# EAGLE design TrinketBlinkM0B (EAGLE 8.4.2)
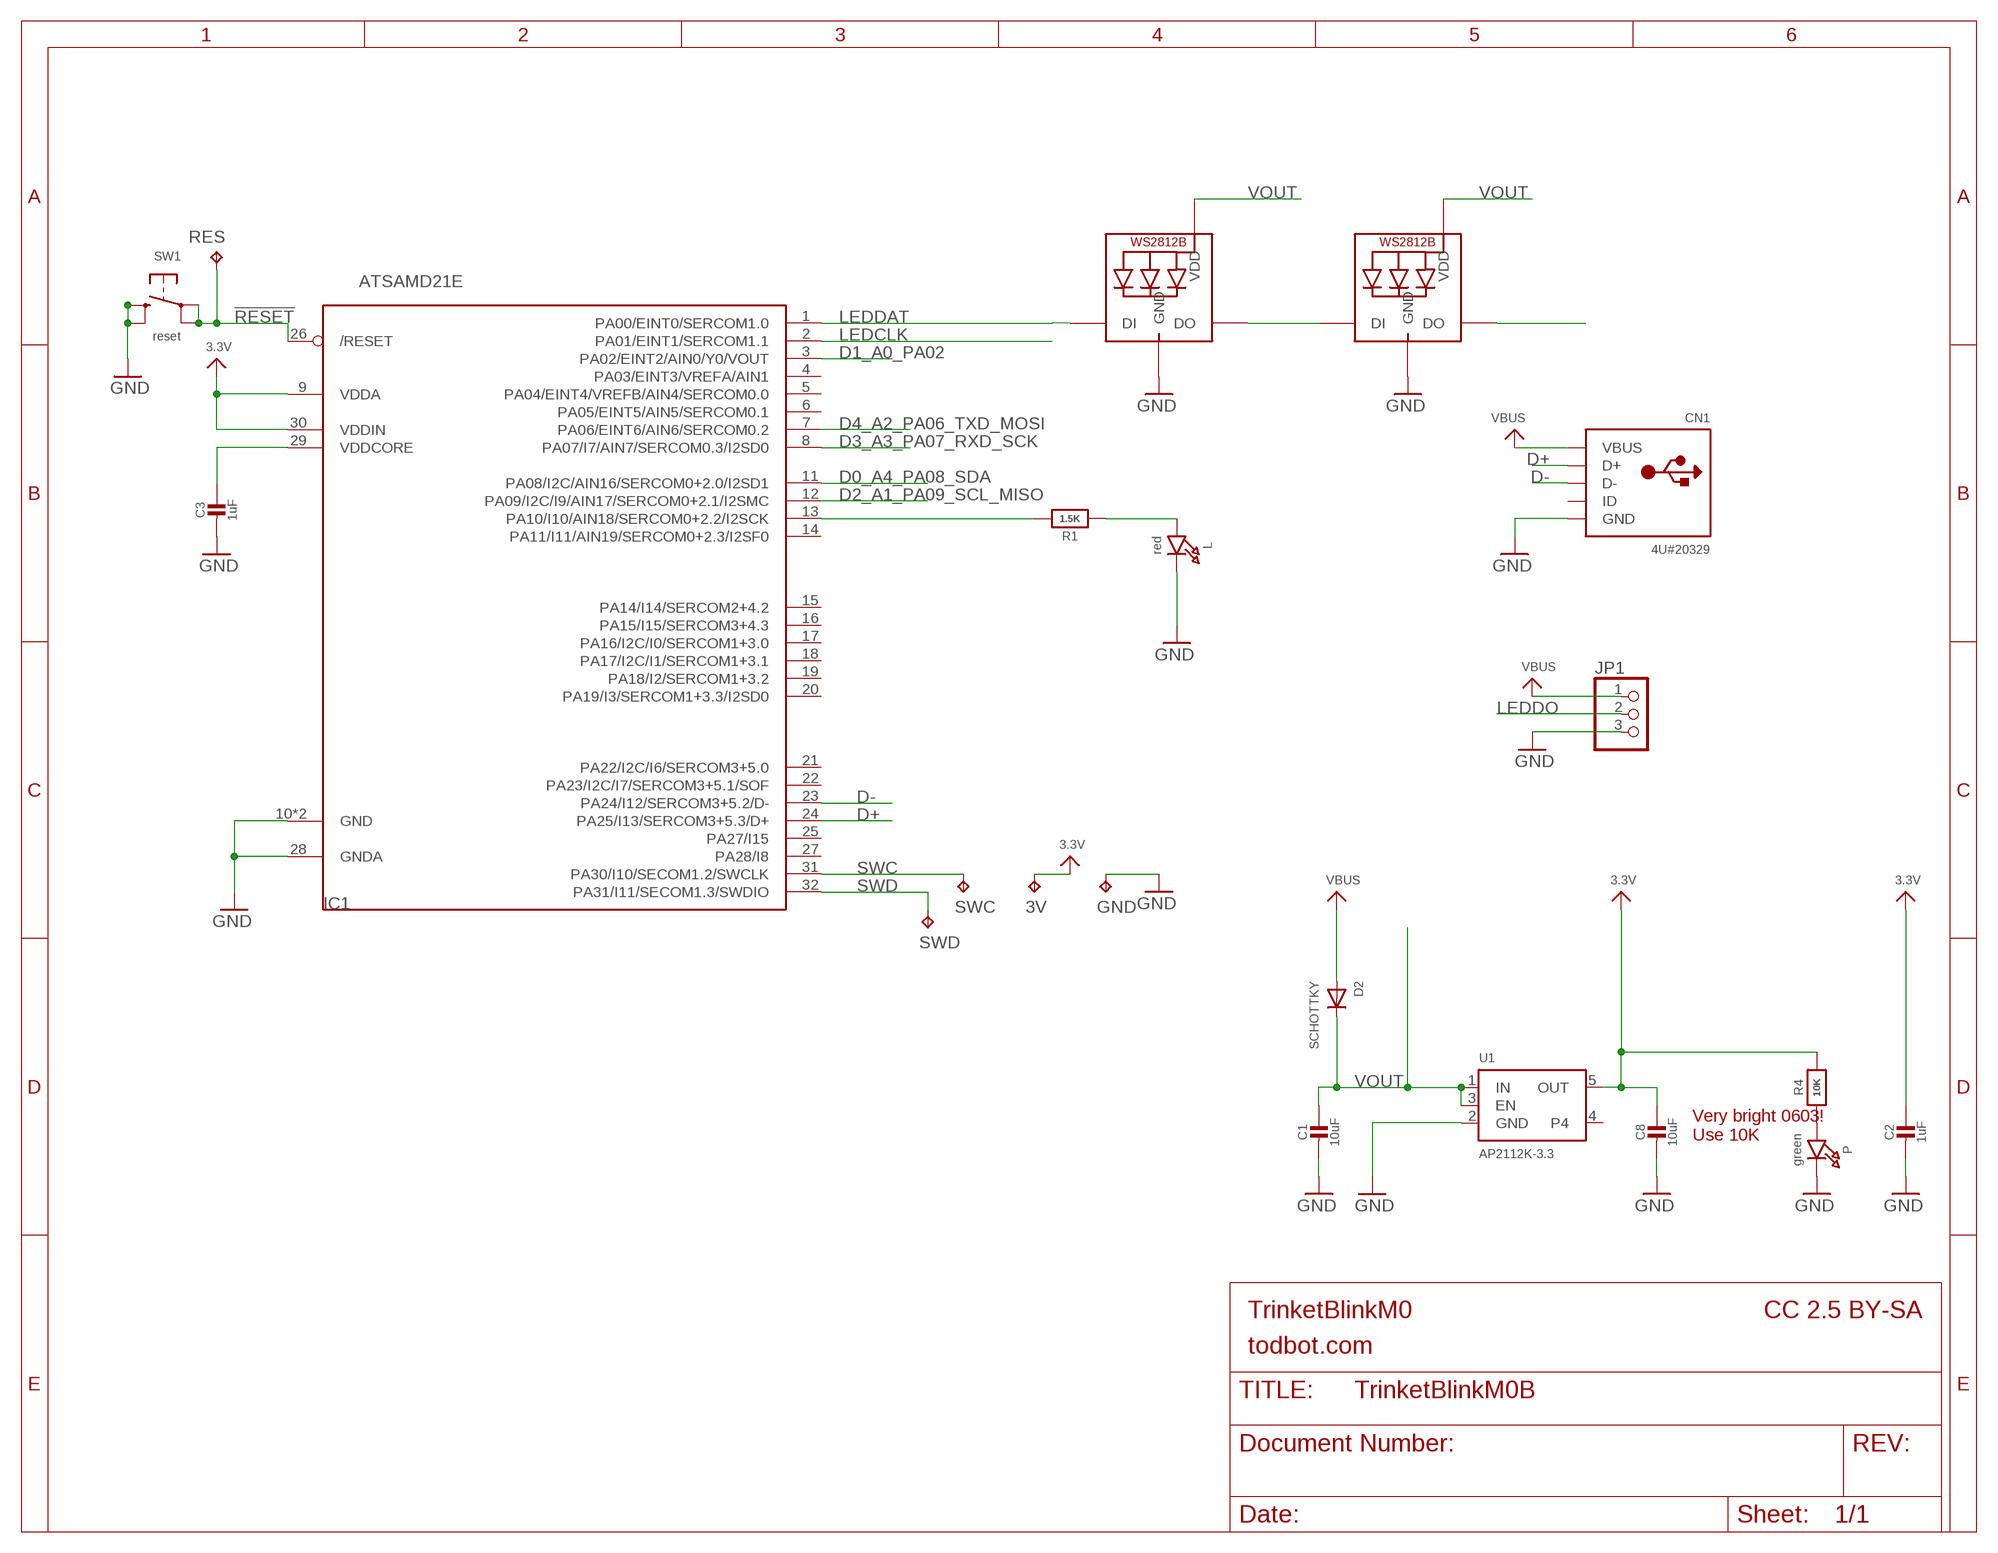
[diagram p0: schematic, sheet 1]

## Parts
3V  TPB1,27  [B1,27]
C1  10uF  CAP_CERAMIC0805-NOOUTLINE  [0805-NO]
C2  1uF  CAP_CERAMIC0603_NO  [0603-NO]
C3  1uF  CAP_CERAMIC0603_NO  [0603-NO]
C8  10uF  CAP_CERAMIC0805-NOOUTLINE  [0805-NO]
CN1  4U#20329  USB_MICRO_20329_V2  [4UCONN_20329_V2]
D2  SCHOTTKY  DIODE_SOD-123FL  [SOD-123FL]
GND  TPB1,27  [B1,27]
IC1  ATSAMD21E  [QFN32_5MM]
JP1  PINHD-1X3CB  [1X03-CLEANBIG]
L  red  LED0603_NOOUTLINE  [CHIPLED_0603_NOOUTLINE]
LED1  WS2812B_5050N  [WS2812B-NARROW]
LED2  WS2812B_5050N  [WS2812B-NARROW]
P  green  LED0603_NOOUTLINE  [CHIPLED_0603_NOOUTLINE]
R1  1.5K  RESISTOR_0603_NOOUT  [0603-NO]
R4  10K  RESISTOR_0603_NOOUT  [0603-NO]
RES  TPB1,27  [B1,27]
SW1  reset  SWITCH_TACT_SMT4.6X2.8  [BTN_KMR2_4.6X2.8]
SWC  TPB1,27  [B1,27]
SWD  TPB1,27  [B1,27]
U1  AP2112K-3.3  VREG_SOT23-5  [SOT23-5]

## Nets
3.3V: 3V.TP C2.1 C8.1 IC1.9(VDDA) IC1.30(VDDIN) R4.2 U1.5(OUT)
!RESET: IC1.26(/RESET) RES.TP SW1.A'(P1) SW1.A(P)
D0_A4_PA08_SDA: IC1.11(PA08/I2C/AIN16/SERCOM0+2.0/I2SD1)
D1_A0_PA02: IC1.3(PA02/EINT2/AIN0/Y0/VOUT)
D2_A1_PA09_SCL_MISO: IC1.12(PA09/I2C/I9/AIN17/SERCOM0+2.1/I2SMC)
D3_A3_PA07_RXD_SCK: IC1.8(PA07/I7/AIN7/SERCOM0.3/I2SD0)
D4_A2_PA06_TXD_MOSI: IC1.7(PA06/EINT6/AIN6/SERCOM0.2)
D+: CN1.D+ IC1.24(PA25/I13/SERCOM3+5.3/D+)
D-: CN1.D- IC1.23(PA24/I12/SERCOM3+5.2/D-)
GND: C1.2 C2.2 C3.2 C8.2 CN1.BASE@1(GND) CN1.BASE@2(GND) CN1.GND CN1.SPRT@1(GND) CN1.SPRT@2(GND) CN1.SPRT@3(GND) CN1.SPRT@4(GND) GND.TP IC1.10(GND) IC1.28(GNDA) IC1.33(GND) JP1.3 L.C LED1.3-GND(GND) LED2.3-GND(GND) P.C SW1.B'(S1) SW1.B(S) U1.2(GND)
LEDCLK: IC1.2(PA01/EINT1/SERCOM1.1)
LEDDAT: IC1.1(PA00/EINT0/SERCOM1.0) LED1.4-DIN(DI)
LEDDO: JP1.2 LED2.2-DOUT(DO)
N$1: L.A R1.1
N$2: IC1.13(PA10/I10/AIN18/SERCOM0+2.2/I2SCK) R1.2
N$3: LED1.2-DOUT(DO) LED2.4-DIN(DI)
N$6: P.A R4.1
SWC: IC1.31(PA30/I10/SECOM1.2/SWCLK) SWC.TP
SWD: IC1.32(PA31/I11/SECOM1.3/SWDIO) SWD.TP
VBUS: CN1.VBUS D2.A JP1.1
VDDCORE: C3.1 IC1.29(VDDCORE)
VOUT: C1.1 D2.C LED1.1-VDD(VDD) LED2.1-VDD(VDD) U1.1(IN) U1.3(EN)
Unconnected: CN1.ID IC1.4(PA03/EINT3/VREFA/AIN1) IC1.5(PA04/EINT4/VREFB/AIN4/SERCOM0.0) IC1.6(PA05/EINT5/AIN5/SERCOM0.1) IC1.14(PA11/I11/AIN19/SERCOM0+2.3/I2SF0) IC1.15(PA14/I14/SERCOM2+4.2) IC1.16(PA15/I15/SERCOM3+4.3) IC1.17(PA16/I2C/I0/SERCOM1+3.0) IC1.18(PA17/I2C/I1/SERCOM1+3.1) IC1.19(PA18/I2/SERCOM1+3.2) IC1.20(PA19/I3/SERCOM1+3.3/I2SD0) IC1.21(PA22/I2C/I6/SERCOM3+5.0) IC1.22(PA23/I2C/I7/SERCOM3+5.1/SOF) IC1.25(PA27/I15) IC1.27(PA28/I8) U1.4

## Notes on the sheet
- Very bright 0603!
  Use 10K
- TrinketBlinkM0 | CC 2.5 BY-SA
- todbot.com

## Library data of the parts
3V GND RES SWC SWD = testpad:TP: Test pad
C1-C3 C8 = microbuilder:CAP_CERAMIC: Ceramic Capacitors For new designs, use the packages preceded by an '_' character since they are more reliable: The following footprints should be used on most boards: _0402 - Standard footprint for regular board layouts _0603 - Standard footprint for regular board layouts _0805 - Standard footprint for regular board layouts _1206 - Standard footprint for regular board layouts For extremely tight-pitch boards where space is at a premium, the following 'micro-pitch' footprints can be used (smaller pads, no silkscreen outline, etc.): _0402MP - Micro-pitch footprint for very dense/compact boards _0603MP - Micro-pitch footprint for very dense/compact boards _0805MP - Micro-pitch footprint for very dense/compact boards _1206MP - Micro-pitch footprint for very dense/compact boards
CN1 = microbuilder:USB: USB Connectors USBMINIB - Surface Mount Female Mini-B USB Connector 4UConnector: 06564
D2 = adafruit:DIODE: Diode SMADIODE - SMA Surface Mount Package 20V 1A Schottky Diode Digikey: 641-1014-6-ND DO-1N4148 - Through Hole Small Current Diode SOD-123 20V 1 A (.5mV Vf) Schottky Diode - Digikey: MBRX120TPMSCT-ND SOD-323 10V 570mA (.38mV Vf, 3ns) Schottky Diode - Digikey: ZLLS410CT-ND SOD-523 30V 30mA Schottky Diode (RB751S-40TE61) - Digikey: RB751S-40TE61CT-ND SOT23-R/W - SOT23 Package (R = Solder Paste/Reflow Ovens, W = Hand-Soldering) BAT54Film 40V 300mA - Digikey: 497-7162-1-ND
IC1 = microbuilder:ATSAMD21E
JP1 = adafruit:PINHD-1X3: PIN HEADER
L P = microbuilder:LED: LED 0603 - 0603 Surface Mount Package 2mA: Green LED - Low Power (3.9mcd, 2ma, 1.7Vf) - Digikey: 475-2709-2-ND Orange LED - Low Power (9.8mcd, 2ma, 1.8Vf) - Digikey: 475-1194-2-ND Red LED - Low Power (5mcd, 2ma, 1.8Vf) - Digikey: 475-1195-2-ND Yellow LED - Low Power (7mcd, 2ma, 1.8Vf) - Digikey: 475-1196-2-ND 5mA: Blue LED - Low Power (17mcd, 5ma, 2.9Vf) - Digikey: LNJ937W8CRACT-ND 0805 - 0805 Surface Mount Package 2mA: Red LED (8.8mcd, 2mA, 1.8Vf, Clear) - Low Power [Digikey: 475-2510-1-ND] Green LED (5mcd, 2mA, 1.8Vf, Clear) - Low Power [Digikey: 475-2730-1-ND] Yellow LED (11.3mcd, 2mA, 1.8Vf, Clear) - Low Power [Digikey: 475-2555-1-ND] 20mA: Red LED (104mcd, 20mA, Diffused) - LS R976 [Digikey: 475-1278-6-ND] Red LED (12mcd, 20mA, 2.0Vf, Clear) - APT2012EC [Digikey: 754-1128-1-ND] Green LED (15mcd, 20mA, 2.2Vf, Clear) - APT2012GC [Digikey: 754-1131-1-ND] Orange LED (160mcd, 20mA, 2.1Vf, Clear) - APT2012SECK [Digikey: 754-1130-1-ND] 1206 - 1206 Surface Mount Package Green LED (26mcd, 20mA, Diffused) - LG N971 [Digikey: 475-1407-6-ND] Red LED (15mcd, 20mA, Diffused) - LH N974 [Digikey: 475-1416-6-ND] Cree - Cree High-Power Surface Mount LEDs XPEBWT-L1-0000-00D50 - White 111lm 350mA 2.9Vf 6200K 110° XTEAWT-00-0000-00000LEE3 - White 114lm 350mA 2.85Vf 5000K 115° Everlight - Everlight 45-21 Series Surface Mount LEDs 45-21/QK2C-B2832AC2CB2/2T - Warm White 2000mcd 20mA 3.25Vf 3050K 120° 45-21/LK2C-B38452C4CB2/2T - Nuetral White 2000mcd 20mA 3.25Vf 4150K 120° 45-21/LK2C-B50634C6CB2/2T - Cold White 2200mcd 20mA 3.25Vf 5650K 120° PLCC2 Reverse Mount LS T77K-J1L2-1-0-2-R18-Z - Red 11.25mcd 2mA 1.8Vf 630nm 120° LO T77K-L1M2-24-Z - Orange 19.6mcd 2mA 1.8Vf 606nm 120° LY T77K-K2M1-26-Z - Yellow 15.7mcd 2mA 1.8Vf 587nm 120°
LED1 LED2 = adafruit:WS2812B
R1 R4 = microbuilder:RESISTOR: Resistors For new designs, use the packages preceded by an '_' character since they are more reliable: The following footprints should be used on most boards: _0402 - Standard footprint for regular board layouts _0603 - Standard footprint for regular board layouts _0805 - Standard footprint for regular board layouts _1206 - Standard footprint for regular board layouts For extremely tight-pitch boards where space is at a premium, the following 'micro-pitch' footprints can be used (smaller pads, no silkscreen outline, etc.): _0402MP - Micro-pitch footprint for very dense/compact boards _0603MP - Micro-pitch footprint for very dense/compact boards _0805MP - Micro-pitch footprint for very dense/compact boards _1206MP - Micro-pitch footprint for very dense/compact boards
SW1 = microbuilder:SWITCH_TACT_SMT: SMT Tact Switches 6x6mm - Digikey: P12940SCT-ND KMR2 (4.6x2.8mm) - Digikey: 401-1426-1-ND EVQ-PQHB55 - Light Touch, 160GF (4.5x4.5mm) - Digikey: P8090SCT-ND KMT0 - KMT021 NGJ LHS (etc.) IP68/Waterproof - Digikey: CKN10289CT-ND
U1 = microbuilder:VREG_SOT23-5: SOT23-5 Fixed Voltage Regulators Part Current Out V Out V In V Dropout θJA (°C/W) TJ (°C) Digikey Part No. ADP121 150mA 3.3V 3.4-5.5V 0.09V @ 150mA -- -- ADP121-AUJZ33R7CT-ND ADP121 150mA 3.0V 3.1-5.5V 0.09V @ 150mA -- -- ADP121-AUJZ30R7CT-ND ADP122 300mA 3.3V 3.4-5.5V 0.085V @ 300mA -- -- ADP122AUJZ-3.3-R7CT-ND ADP1712 300mA 3.3V 3.5-5.5V 0.17V @ 300mA -- -- ADP1712AUJZ-3.3-R7TR-ND AP7311 (Low Cost) 150mA 3.3V 3.5-6V 0.15V @ 150mA -- -- AP7311-33WG-7DICT-ND LD39015M18R 150mA 1.8V 1.9V-5.5V 0.08V @ 100mA -- -- 497-6977-1-ND LP2985A-33DBVR 150mA 3.3V 3.3-16V 0.28V @ 150mA 206 150 296-18479-1-ND MCP1824T-3302E/OT 300mA 3.3V 3.5V-6V 0.2V @ 300mA -- -- MCP1824T-3302E/OTCT-ND MIC5205-2.5YM5 TR 150mA 2.5V 2.7-16V 0.165V @ 150mA -- -- 576-1257-2-ND MIC5205-3.0YM5 TR 150mA 3.0V 3.2V-16V 0.165V @ 150mA -- -- 576-1258-2-ND MIC5205-3.3YM5 TR 150mA 3.3V 3.5V-16V 0.165V @ 150mA -- -- 576-1259-2-ND TPS780330220 150mA 3.3V+2.2V 3.6-5.5V 250mV Max -- -- 296-23332-1-ND TDA3663/N1,135 100mA 3.3V 3.5-45V 0.18V @ 50mA -- -- 568-5343-1-ND Max operating temp can be calculated using θJA, TJ (max junction temperature), and power in watts. Set the "Maximum Ambient Temperature" until it reaches TJ ("Max Junction Temperature"), which is the absolute limit for safe use of the regulator: Heat Sink Temperature Calculator <http://www.daycounter.com/Calculators/Heat-Sink-Temperature-Calculator.phtml> For example, With 12V source into a 3.3V LP2985 and a 30mA load, we are dissipating (12V-3.3V) * 0.03A = 0.261W. With a θJA of 206 °C/W, a TJ of 150°C, and 261mW we can safely use the chip without a heat sink up to 75°C (=147.1°C Junction Temperature).

## Net classes
1 power: width 0.305 mm

## Board
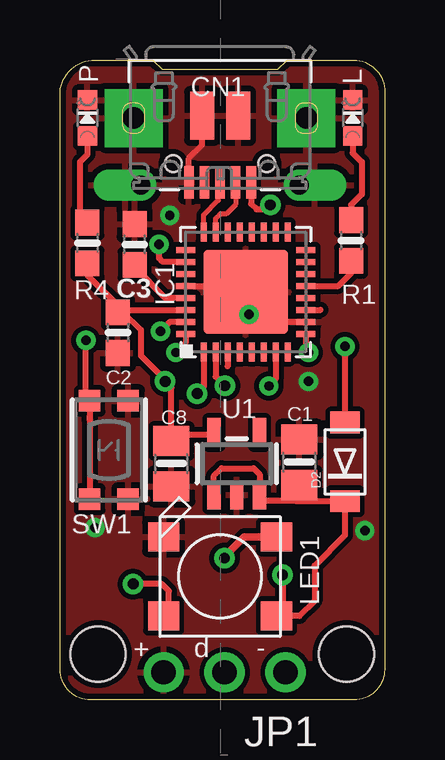
[diagram p1: board, top side]
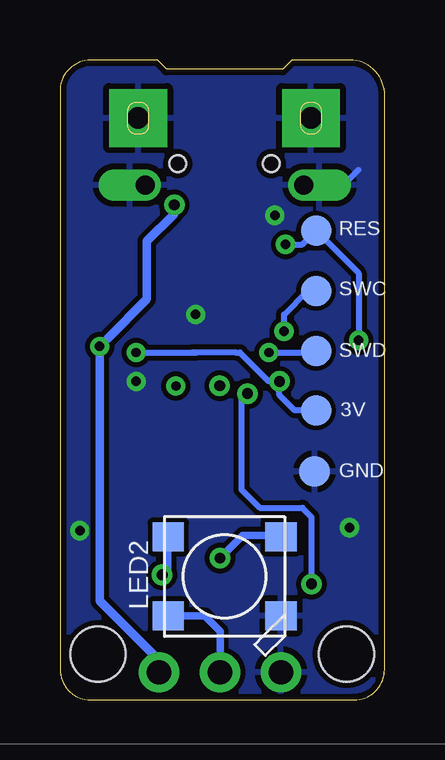
[diagram p2: board, bottom side, seen from below]

Size 13.53 x 26.68 mm. Coordinates in mm from the lower left corner, seen from the top.
Outline: 13.53,25.46 13.53,2.35 13.53,1.27 arc-90 12.26,0 1.27,0 arc-90 0,1.27 0,1.71 0,25.34 arc-90 1.59,26.67 3.87,26.67 4.25,26.29 9.08,26.29 9.46,26.67 12.13,26.67 arc-90 13.53,25.46
Copper layers (1*16): Top 0.035mm / dielectric 1.5mm / Bottom 0.035mm
Design rules "adafruit *": minimum track width 8mil, minimum drill 15.5mil, track to track 8mil, track to pad 8mil, pad to pad 8mil, via to via 8mil, smd to smd 8mil, copper to edge 10mil, drill to drill 8mil, minimum pad ring 10mil, minimum via ring 8mil, stop-mask expansion 2mil, vias tented up to drill 20mil, thermal gap 10mil
Holes 2.29 mm at 1.59,1.91 11.94,1.91

### Footprints (pad centres in the part's own frame; a part is rotated, then mirrored left to right if it is on the bottom)
B1,27 = smd 1.27 x 1.27: TP 0,0
0805-NO = smd 1.24 x 1.5: 1 -0.95,0; 2 0.95,0
0603-NO = smd 1.075 x 1: 1 -0.85,0; 2 0.85,0
4UCONN_20329_V2 = smd 1 x 2: BASE@1 -0.75,-2; BASE@2 0.75,-2 | smd 0.4 x 1.35: D+ 0,0.775; D- -0.65,0.775; GND 1.3,0.775; ID 0.65,0.775; VBUS -1.3,0.775 | drill 0.8 pad 1.143 offset: SPRT@1 -3.3,0.9; SPRT@2 3.3,0.9 | drill 0.9 pad 2.413 square: SPRT@3 -3.6,-1.9; SPRT@4 3.6,-1.9 | hole 0.7: -1.95,0; 1.95,0
SOD-123FL = smd 0.91 x 1.22: A 1.637,0; C -1.637,0
QFN32_5MM = smd 0.8 x 0.25: 1 -2.5,1.75; 2 -2.5,1.25; 3 -2.5,0.75; 4 -2.5,0.25; 5 -2.5,-0.25; 6 -2.5,-0.75; 7 -2.5,-1.25; 8 -2.5,-1.75; 17 2.5,-1.75; 18 2.5,-1.25; 19 2.5,-0.75; 20 2.5,-0.25; 21 2.5,0.25; 22 2.5,0.75; 23 2.5,1.25; 24 2.5,1.75 | smd 0.25 x 0.8: 9 -1.75,-2.5; 10 -1.25,-2.5; 11 -0.75,-2.5; 12 -0.25,-2.5; 13 0.25,-2.5; 14 0.75,-2.5; 15 1.25,-2.5; 16 1.75,-2.5; 25 1.75,2.5; 26 1.25,2.5; 27 0.75,2.5; 28 0.25,2.5; 29 -0.25,2.5; 30 -0.75,2.5; 31 -1.25,2.5; 32 -1.75,2.5 | smd 3.5 x 3.5: 33 0,0
1X03-CLEANBIG = drill 1.016 pad 1.676: 1 -2.54,0; 2 0,0; 3 2.54,0
CHIPLED_0603_NOOUTLINE = smd 0.8 x 0.8: A 0,-0.75; C 0,0.75
WS2812B-NARROW = smd 1.3 x 1.2: 1-VDD 2.35,-1.65; 2-DOUT 2.35,1.65; 3-GND -2.35,1.65; 4-DIN -2.35,-1.65
BTN_KMR2_4.6X2.8 = smd 0.9 x 0.9: A 2.05,0.8; A' -2.05,0.8; B 2.05,-0.8; B' -2.05,-0.8
SOT23-5 = smd 0.55 x 1.2: 1 -0.95,-1.3; 2 0,-1.3; 3 0.95,-1.3; 4 0.95,1.3; 5 -0.95,1.3

### Placement (x,y rotation side)
3V  2.86,12.07 0 bottom
C1  9.97,9.91 90 top
C2  2.41,15.3 270 top
C3  3.11,18.99 90 top
C8  4.64,9.84 270 top
CN1  6.67,22.35 180 top
D2  11.87,9.92 90 top
GND  2.92,9.53 0 bottom
IC1  7.74,17 90 top
JP1  6.86,1.14 180 top
L  12.19,24.26 0 top
LED1  6.67,5.14 0 top
LED2  6.67,5.14 180 bottom
P  1.14,24.26 0 top
R1  12.13,19.15 270 top
R4  1.14,19.05 270 top
RES  2.86,19.56 0 bottom
SW1  2.04,10.41 90 top
SWC  2.86,17.04 0 bottom
SWD  2.86,14.54 0 bottom
U1  7.37,9.84 0 top
U$1  [TRINKET_M0_BOTTOM]  14.29,0 0 bottom
U$20  [TRINKET_M0_TOP]  -0.95,0 0 top

### Tracks (layer width: path | path; a pad name or v marks a point on that pad's centre or on a via)
3.3V  (via drill 0.39, 0.45)
  Top 0.254: IC1.9 10.24,14.59 v10.35,14.48 | R4.2 1.14,17.72 2.61,16.25 | 4.29,11.14 4.38,11.14 4.64,10.89 C8.1 4.64,11.05 | 2.61,16.25 IC1.30 | 2.61,16.25 2.51,16.25 C2.1 2.64,16.15 3.37,15.43 3.37,14.35 4.38,13.34 v4.38,13.27 4.64,13.02 4.64,11.05 | U1.5 6.41,11.05 4.64,11.05
  Bottom 0.254: v10.35,14.48 8,14.48 | 8,14.48 7.81,14.48 | 6.22,14.48 8,14.48 | 6.22,14.48 6.03,14.48 | 6.22,14.48 6.03,14.48 | 6.03,14.48 4.83,13.27 v4.38,13.27 4.38,12.7 3.75,12.07 3V.TP
!RESET  (via drill 0.39)
  Top 0.254: IC1.26 4.29,18.25 4.13,18.41 v4.13,18.99 | 1.23,11.81 1.24,11.81 1.24,11.68 | v1.08,14.99 1.08,12.62 SW1.A 1.24,11.68 | 1.24,11.68 SW1.A'
  Bottom 0.254: v1.08,14.99 1.08,17.78 RES.TP 3.43,18.99 v4.13,18.99
D0_A4_PA08_SDA
  Top 0.254: IC1.11 10.86,16.25
D1_A0_PA02
  Top 0.254: IC1.3 6.99,13.9
D4_A2_PA06_TXD_MOSI  (via drill 0.39)
  Top 0.254: v8.7,13.08 8.99,13.37 IC1.7
D+
  Top 0.203: IC1.24 5.99,20.21 6.6,20.83 6.6,21.51
  Top 0.254: 6.6,21.51 CN1.D+
D-
  Top 0.203: CN1.D- 7.32,20.65 6.92,20.26 6.67,20.26 6.49,20.08 IC1.23
GND  (via drill 0.39)
  Top 0.254: v7.87,16.07 7.74,16.2 IC1.33 arc90 7.49,17.25 IC1.28 | 7.87,15.88 v7.87,16.07 | CN1.GND 5.37,22.58 5.92,23.13 CN1.BASE@2 | IC1.10 8.19,15.75 arc-90 v7.87,16.07 | 2.32,23.51 CN1.SPRT@4
  Bottom 0.254: CN1.SPRT@2 1.73,21.45 1.08,22.1
  other vias: 12.7,7.05 1.46,7.18 4.57,20.19 10.35,13.27
  pour Bottom: -0.95,26.67 -0.95,0 14.29,0 14.29,26.67
  pour Top: -1.4,26.86 -1.4,0.19 15.11,0.06 15.11,26.73
LEDCLK  (via drill 0.45)
  Top 0.254: IC1.2 6.49,13.47 v6.87,13.09
LEDDAT  (via drill 0.45)
  Top 0.254: v5.71,12.76 5.99,13.04 IC1.1 | LED1.4-DIN 4.54,3.49 4.54,4.54 4.24,4.83 v3.05,4.83
  Bottom 0.254: v5.71,12.76 5.97,12.51 5.97,8.76 5.21,8 3.43,8 3.05,7.62 v3.05,4.83
LEDDO
  Bottom 0.305: JP1.2 6.86,2.86 7.49,3.49 9.27,3.49 LED2.2-DOUT
N$1
  Top 0.254: L.A 12.19,22.8 12.57,22.41 12.57,21.08 12.13,20.64 R1.1
N$2
  Top 0.254: IC1.13 11.6,17.25 12.13,17.78 R1.2
N$3  (via drill 0.45)
  Top 0.305: LED1.2-DOUT 7.68,6.79 6.86,5.97 v6.86,5.91
  Bottom 0.254: LED2.4-DIN 4.32,6.86
  Bottom 0.305: v6.86,5.91 5.91,6.86 4.32,6.86 | LED2.4-DIN
N$6
  Top 0.254: P.A 1.14,22.73 0.83,22.41 0.83,20.22 R4.1
SWC  (via drill 0.39)
  Top 0.254: IC1.31 4.58,15.75 v4.19,15.37
  Bottom 0.254: 2.86,16.7 SWC.TP 3.21,17.04 4.19,16.07 v4.19,15.37
SWD  (via drill 0.39)
  Top 0.254: IC1.32 5.24,14.89 v4.83,14.48
  Bottom 0.254: SWD.TP 2.92,14.48 v4.83,14.48
VBUS  (via drill 0.39, 0.45)
  Top 0.254: CN1.VBUS 7.97,20.67 8.19,20.45 8.57,20.45 v8.76,20.64 | v11.87,14.73 11.87,14.54 11.87,14.35 D2.A
  Bottom 0.254: 11.56,15.05 v11.87,14.73
  Bottom 0.305: 9.4,1.65 JP1.1
  Bottom 0.356: v8.76,20.64 8.76,20.26 9.91,19.11 9.91,16.7 11.56,15.05 | 9.4,1.65 11.87,4.13 v11.87,14.73
VDDCORE
  Top 0.254: IC1.29 4.39,16.75 3.11,18.03 C3.1
VOUT  (via drill 0.45)
  Top 0.254: 8.25,8.54 U1.3 8.32,9.4 8.06,9.65 6.73,9.65 6.42,9.34 U1.1 | 8.25,8.54 U1.3 | 9.84,8.83 9.84,8.54 | 9.84,8.28 D2.C 11.87,6.86 10.6,5.59 10.6,4.13 9.97,3.49 LED1.1-VDD 9.27,3.49 v9.27,5.21 | 9.84,8.28 9.84,8.83 | 9.84,8.28 8.25,8.28 8.25,8.54 | C1.1 9.84,8.83
  Bottom 0.254: LED2.1-VDD 9.02,5.21 v9.27,5.21

### Text on the board
tPlace: + | d | -